# Altium schematic sheet MCU.SchDoc
size A4; SheetNumber: 2; SheetTotal: 3
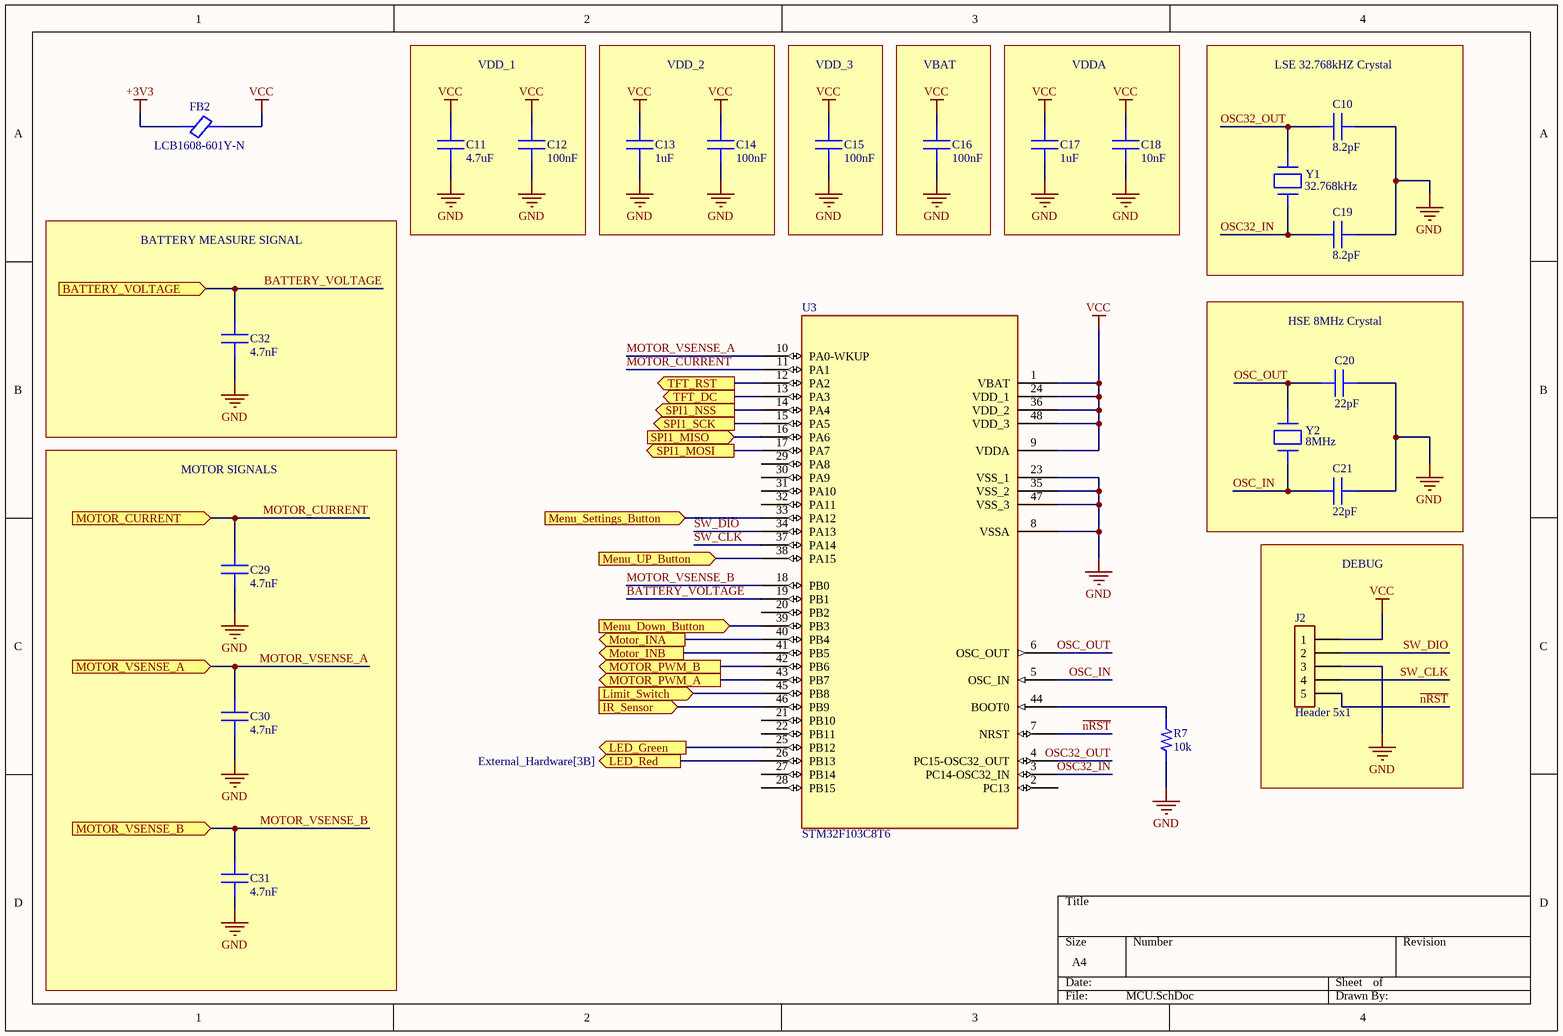
[diagram p0: MCU.SchDoc]

## Parts
C10  8.2pF  [CAPC2012X145N 0805]
C11  4.7uF  [CAPC2012X145N 0805]
C12  100nF  [CAPC 0603 1608X90N]
C13  1uF  [CAPC 0603 1608X90N]
C14  100nF  [CAPC 0603 1608X90N]
C15  100nF  [CAPC 0603 1608X90N]
C16  100nF  [CAPC 0603 1608X90N]
C17  1uF  [CAPC 0603 1608X90N]
C18  10nF  [CAPC 0603 1608X90N]
C19  8.2pF  [CAPC2012X145N 0805]
C20  22pF  [CAPC 0603 1608X90N]
C21  22pF  [CAPC 0603 1608X90N]
C29  4.7nF  [CAPC1608X90N 0603]
C30  4.7nF  [CAPC1608X90N 0603]
C31  4.7nF  [CAPC1608X90N 0603]
C32  4.7nF  [CAPC1608X90N 0603]
FB2  LCB1608-601Y-N  [MPZ1608S601ATA00 0603 1608X95N]
J2  Header 5x1  [Header 5x1 FEMALE Header]
R7  10k  [RES 0603 ROYALOHM]
U3  STM32F103C8T6  [LQFP48_STM]
Y1  32.768kHz  [XTAL_ABS07-120-32.768KHZ-T]
Y2  8MHz  [XTAL_J49SMH-A-G-G-K-8M0_JAU]

## Blocks framed on the sheet
VDD_1: C11 C12
VDD_2: C13 C14
VDD_3: C15
VBAT: C16
VDDA: C17 C18
LSE 32.768kHZ Crystal: C10 C19 Y1
BATTERY MEASURE SIGNAL: C32
HSE 8MHz Crystal: C20 C21 Y2
MOTOR SIGNALS: C29-C31
DEBUG: J2

## Ports
BATTERY_VOLTAGE (in, see Power[3C]), IR_Sensor (in, see External_Hardware[2A]), LED_Green (out, see External_Hardware[3B]), LED_Red (out, see External_Hardware[3B]), Limit_Switch (in, see External_Hardware[3A]), Menu_Down_Button (in, see External_Hardware[2B]), Menu_Settings_Button (in, see External_Hardware[2B]), Menu_UP_Button (in, see External_Hardware[2B]), MOTOR_CURRENT (in, see External_Hardware[2C]), Motor_INA (out, see External_Hardware[1D]), Motor_INB (out, see External_Hardware[1C]), MOTOR_PWM_A (out, see External_Hardware[1C]), MOTOR_PWM_B (out, see External_Hardware[1C]), MOTOR_VSENSE_A (in, see External_Hardware[2C]), MOTOR_VSENSE_B (in, see External_Hardware[2C]), SPI1_MISO (in, see External_Hardware[4B]), SPI1_MOSI (out, see External_Hardware[4A]), SPI1_NSS (out, see External_Hardware[4B]), SPI1_SCK (out, see External_Hardware[4B]), TFT_DC (out, see External_Hardware[4B]), TFT_RST (out, see External_Hardware[4B])

## Nets
+3V3: FB2.1
GND: C10.2 C11.1 C12.1 C13.1 C14.1 C15.1 C16.1 C17.1 C18.1 C19.2 C20.2 C21.2 C29.1 C30.1 C31.1 C32.1 J2.3 R7.1 U3.8(VSSA) U3.23(VSS_1) U3.35(VSS_2) U3.47(VSS_3)
VCC: C11.2 C12.2 C13.2 C14.2 C15.2 C16.2 C17.2 C18.2 FB2.2 J2.1 U3.1(VBAT) U3.9(VDDA) U3.24(VDD_1) U3.36(VDD_2) U3.48(VDD_3)
BATTERY_VOLTAGE: C32.2 U3.19(PB1) ; port BATTERY_VOLTAGE
IR_Sensor: U3.46(PB9) ; port IR_Sensor
LED_Green: U3.25(PB12) ; port LED_Green
LED_Red: U3.26(PB13) ; port LED_Red
Limit_Switch: U3.45(PB8) ; port Limit_Switch
Menu_Down_Button: U3.39(PB3) ; port Menu_Down_Button
Menu_Settings_Button: U3.33(PA12) ; port Menu_Settings_Button
Menu_UP_Button: U3.38(PA15) ; port Menu_UP_Button
MOTOR_CURRENT: C29.2 U3.11(PA1) ; port MOTOR_CURRENT
Motor_INA: U3.40(PB4) ; port Motor_INA
Motor_INB: U3.41(PB5) ; port Motor_INB
MOTOR_PWM_A: U3.43(PB7) ; port MOTOR_PWM_A
MOTOR_PWM_B: U3.42(PB6) ; port MOTOR_PWM_B
MOTOR_VSENSE_A: C30.2 U3.10(PA0-WKUP) ; port MOTOR_VSENSE_A
MOTOR_VSENSE_B: C31.2 U3.18(PB0) ; port MOTOR_VSENSE_B
~{nRST}: J2.5 U3.7(NRST)
OSC32_IN: C19.1 U3.3(PC14-OSC32_IN) Y1.1
OSC32_OUT: C10.1 U3.4(PC15-OSC32_OUT) Y1.2
OSC_IN: C21.1 U3.5(OSC_IN) Y2.1
OSC_OUT: C20.1 U3.6(OSC_OUT) Y2.2
SPI1_MISO: U3.16(PA6) ; port SPI1_MISO
SPI1_MOSI: U3.17(PA7) ; port SPI1_MOSI
SPI1_NSS: U3.14(PA4) ; port SPI1_NSS
SPI1_SCK: U3.15(PA5) ; port SPI1_SCK
SW_CLK: J2.4 U3.37(PA14)
SW_DIO: J2.2 U3.34(PA13)
TFT_DC: U3.13(PA3) ; port TFT_DC
TFT_RST: U3.12(PA2) ; port TFT_RST
NetR7_2: R7.2 U3.44(BOOT0)

Not connected (* = marked no-connect by the designer): U3 2(PC13) 20(PB2) 21(PB10) 22(PB11) 27(PB14) 28(PB15) 29(PA8) 30(PA9) 31(PA10) 32(PA11)

## Library data of the parts
C10 C19 = CAP 0805 8.2pF CC0805DRNPO9BN8R2: MLCC (2012) 0805 8.2pF 50VDC ±0.5pF C0G (NP0); Manufacturer: YAGEO; Capacitance: 8.2pF; Voltage Rating: 50VDC; Dielectric: C0G (NP0); Package Size: 0805; Operating Temp.: -55 °C ~ +125 °C; Tolerance: ±0.5 pF; Manufacturer Code: CC0805DRNPO9BN8R2; ComponentLink1Description: Product Site; ComponentLink1URL: https://www.ozdisan.com/p/smt-smd-ve-mlcc-kapasitorler-184/yageo-cc0805drnpo9bn8r2-748686
C11 = CAP 0805 4.7uF CL21B475KOQVPNE: MLCC (2012) 0805 4.7uF 16VDC ±10% X7R AUTOMOTIVE; Manufacturer: SAMSUNG; Capacitance: 4.7uF; Voltage Rating: 16 VDC; Dielectric: X7R; Package Size: 0805; Operating Temp.: -55 °C ~ +125 °C; Tolerance: ±10 %; Manufacturer Product Number: CL21B475KOQVPNE; ComponentLink1Description: Product Site; ComponentLink1URL: https://www.ozdisan.com/p/smt-smd-ve-mlcc-kapasitorler-184/samsung-cl21b475koqvpne-522984
C12 C14-C16 = CAP 0603 100nF CC0603KPX7R8BB104: MLCC (1608) 0603 100nF 25VDC ±10% X7R; Manufacturer: YAGEO; Package / Case: 0603 (1608 Metric); Operating Temperature: -55°C ~ 125°C; Temperature Coefficient: X7R; Voltage - Rated: 25 VDC; Tolerance: ±10%; Capacitance: 100nF; Manufacturer Product Number: CC0603KPX7R8BB104; ComponentLink1Description: Product Site; ComponentLink1URL: https://www.ozdisan.com/p/smt-smd-ve-mlcc-kapasitorler-184/yageo-cc0603kpx7r8bb104-747645
C13 C17 = CAP 0603 1uF C0603C105K4PACTU: MLCC (1608) 0603 1uF 16VDC ±10% X5R; Manufacturer: KEMET; Package / Case: 0603 (1608 Metric); Operating Temperature: -55°C ~ 125°C; Temperature Coefficient: X5R; Voltage - Rated: 16 VDC; Tolerance: ±10%; Capacitance: 1uF; Manufacturer Product Number: C0603C105K4PACTU; ComponentLink1Description: Product Site; ComponentLink1URL: https://www.ozdisan.com/p/smt-smd-ve-mlcc-kapasitorler-184/kemet-c0603c105k4pactu-530892
C18 = CAP 0603 10nF CL10B103KA8NNNC: MLCC (1608) 0603 10nF 25VDC ±10% X7R; Manufacturer: SAMSUNG; Package / Case: 0603 (1608 Metric); Operating Temperature: -55°C ~ 125°C; Temperature Coefficient: X7R; Voltage - Rated: 25VDC; Tolerance: ±10%; Capacitance: 10nF; Manufacturer Product Number: CL10B103KA8NNNC; ComponentLink1Description: Product Site; ComponentLink1URL: https://www.ozdisan.com/p/smt-smd-ve-mlcc-kapasitorler-184/samsung-cl10b103ka8nnnc-354624
C20 C21 = CAP 0603 22pF CC0603JRNPO9BN220: MLCC (1608) 0603 22pF 50VDC ±5% C0G (NP0); Manufacturer: YAGEO; Package / Case: 0603 (1608 Metric); Operating Temperature: -55°C ~ 125°C; Temperature Coefficient: C0G (NP0); Voltage - Rated: 50 VDC; Tolerance: ±5 %; Capacitance: 22pF; Manufacturer Product Number: CC0603JRNPO9BN220; ComponentLink1Description: Product Site; ComponentLink1URL: https://www.ozdisan.com/p/smt-smd-ve-mlcc-kapasitorler-184/yageo-cc0603jrnpo9bn220-576596
C29-C32 = CAP 0603 4.7nF CL10B472KB8NNNC: MLCC (1608) 0603 4.7nF 50VDC ±10% X7R; Manufacturer: SAMSUNG; Operation Temperature: -55 °C ~ +125 °C; Tolerance: ±10 %; Voltage Rating: 50 VDC; Capacitance: 4.7nF; Package / Case: 0603 (1608 Metric); Manufacturer Code: CL10B472KB8NNNC; ComponentLink1Description: Product Site; ComponentLink1URL: https://www.ozdisan.com/p/smt-smd-ve-mlcc-kapasitorler-184/samsung-cl10b472kb8nnnc-14009
FB2 = Ferrite Bead LCB1608-601Y-N: 600 Ohms @ 100 MHz 1 Power Line Ferrite Bead 0603 (1608 Metric) 1A 200mOhm; Manufacturer: CORE MASTER; Tolerance: ±25 %; DCR: 200 m Ohms; Impedance: 600 Ohms; Current: 1 A; Package Size: 0603; Manufacturer Code: LCB1608-601Y-N; ComponentLink1Description: Product Site; ComponentLink1URL: http://ozdisan.com/p/bead-feritler-469/core-master-lcb1608-601y-n-496992
J2 = Header 5x1 Female Header: FEMALE HEADER 5PIN(1x5) 2.54mm THT V/T BAG; Manufacturer Product Number: L-KLS1-208-1-05-S; Manufacturer: KLS ELECTRONIC; Number of Positions: 5; Pitch - Mating: 0.100" (2.54mm); Mounting Type: Through Hole; Contact Type: Female Socket; ComponentLink1Description: Product Site; ComponentLink1URL: https://www.ozdisan.com/p/disi-headerlar-294/kls-electronic-l-kls1-208-1-05-s-479014
R7 = RES 0603 10k 0603SAJ0103T5E: RES.(1608) 0603 10K Ohms 5% 1/10W-S 100PPM; Manufacturer: ROYALOHM; Power (Watts): 0.1W, 1/10W; Operating Temperature: -55°C ~ 155°C; Package / Case: 0603 (1608 Metric); Tolerance: ±5 %; Manufacturer Product Number: 0603SAJ0103T5E; Resistance: 10 kOhms; ComponentLink1Description: Product Site; ComponentLink1URL: https://www.ozdisan.com/p/smt-smd-ve-cip-direncler-194/royalohm-0603saj0103t5e-336243
U3 = STM32F103C8T6: Mainstream Performance line, Arm Cortex-M3 MCU with 64 Kbytes of Flash memory, 72 MHz CPU, motor control, USB and CAN; Manufacturer_Name: STMicroelectronics; Copyright: Copyright (C) 2025 Ultra Librarian. All rights reserved.; Manufacturer_Part_Number: STM32F103C8T6; RefDes: RefDes; Type: Type
Y1 = CRYSTAL 32.768kHz ABS07-120-32.768KHZ-T: CRYSTAL 32.768kHz 6pF SMD; Manufacturer: Abracon LLC; Frequency Tolerance: ±20ppm; Load Capacitance: 6pF; Frequency: 32.768 kHz; Manufacturer Product Number: ABS07-120-32.768KHZ-T; Type: kHz Crystal (Tuning Fork); ComponentLink1Description: Product Site; ComponentLink1URL: https://www.ozdisan.com/p/kristaller-508/abracon-abs07-120-32-768khz-t-446332
Y2 = CRYSTAL 8MHz AS-8.000-16-SMD-TR: CRYSTAL 8MHz HC49SMT 16pF SMD TR RALTRON; Frequency Stability: ±30ppm; Frequency Tolerance: ±50 PPM; Manufacturer: RALTRON; Type: MHz Crystal; Frequency: 8 MHz; Load Capacitance: 16 pF; Operating Temperature: -20 °C ~ +70 °C; Package / Case: HC-49S; Manufacturer Code: AS-8.000-16-SMD-TR; ComponentLink1Description: Product Site; ComponentLink1URL: https://www.ozdisan.com/p/kristaller-508/raltron-as-8-000-16-smd-tr-40447